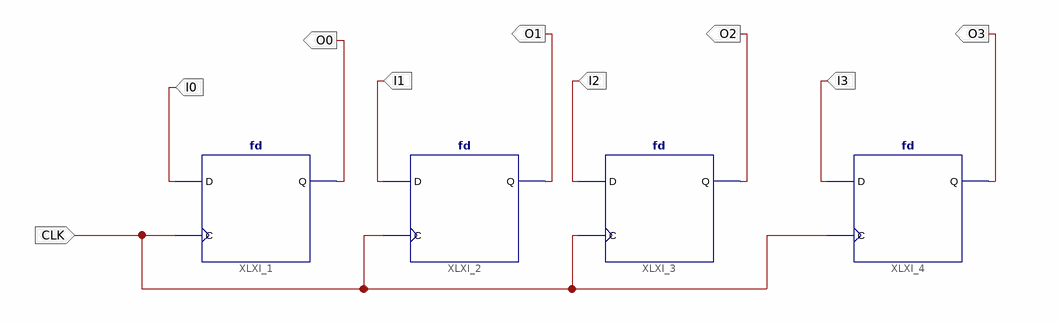
[diagram p0: schematic sheet 1]
// Xilinx ISE schematic Dregister4bits.sch (spartan6) as structural Verilog: 4 symbols, 9 ports
module Dregister4bits (
  input  CLK,
  input  I0,
  input  I1,
  input  I2,
  input  I3,
  output O0,
  output O1,
  output O2,
  output O3
);

  fd XLXI_1 (.C(CLK), .D(I0), .Q(O0));
  fd XLXI_2 (.C(CLK), .D(I1), .Q(O1));
  fd XLXI_3 (.C(CLK), .D(I2), .Q(O2));
  fd XLXI_4 (.C(CLK), .D(I3), .Q(O3));
endmodule
